# EAGLE design Buttons (EAGLE 8.6.0)
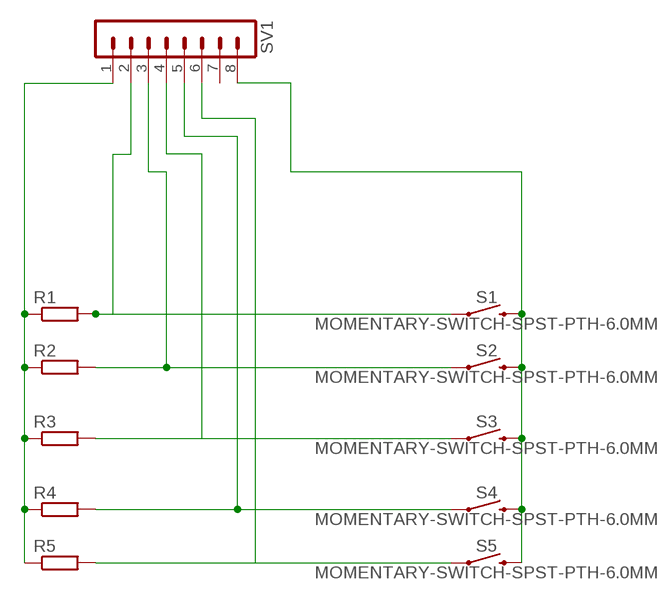
[diagram p0: schematic, sheet 1]

## Parts
R1  R0204/7  [0204/7]
R2  R0204/7  [0204/7]
R3  R0204/7  [0204/7]
R4  R0204/7  [0204/7]
R5  R0204/7  [0204/7]
S1  MOMENTARY-SWITCH-SPST-PTH-6.0MM  [TACTILE_SWITCH_PTH_6.0MM]
S2  MOMENTARY-SWITCH-SPST-PTH-6.0MM  [TACTILE_SWITCH_PTH_6.0MM]
S3  MOMENTARY-SWITCH-SPST-PTH-6.0MM  [TACTILE_SWITCH_PTH_6.0MM]
S4  MOMENTARY-SWITCH-SPST-PTH-6.0MM  [TACTILE_SWITCH_PTH_6.0MM]
S5  MOMENTARY-SWITCH-SPST-PTH-6.0MM  [TACTILE_SWITCH_PTH_6.0MM]
SV1  MA08-1  [MA08-1]

## Nets
N$1: R1.2 S1.1 SV1.2
N$2: R2.2 S2.1 SV1.3
N$3: R3.2 S3.1 SV1.4
N$4: R4.2 S4.1 SV1.5
N$5: R5.2 S5.1 SV1.6
N$6: R1.1 R2.1 R3.1 R4.1 R5.1 SV1.1
N$7: S1.3 S2.3 S3.3 S4.3 S5.3 SV1.8
Unconnected: SV1.7

## Library data of the parts
R1-R5 = eagle-ltspice:R: RESISTOR, European symbol; SPICEMODEL: NONE; SPICEPREFIX: R
S1-S5 = SparkFun-Switches:MOMENTARY-SWITCH-SPST: Momentary Switch (Pushbutton) - SPST Normally-open (NO) SPST momentary switches (buttons, pushbuttons). Variants PTH-12MM - 12mm square, through-hole Momentary Pushbutton Switch - 12mm Square <https://www.sparkfun.com/products/9190> (COM-09190) PTH-6.0MM, PTH-6.0MM-KIT - 6.0mm square, through-hole Mini Pushbutton Switch <https://www.sparkfun.com/products/97> (COM-00097) KIT package intended for soldering kit's - only one side of pads' copper is exposed. PTH-RIGHT-ANGLE-KIT - Right-angle, through-hole Right Angle Tactile Button <https://www.sparkfun.com/products/10791> - Used on SparkFun BigTime Watch Kit <https://www.sparkfun.com/products/11734> SMD-12MM - 12mm square, surface-mount Tactile Button - SMD (12mm) <https://www.sparkfun.com/products/12993> (COM-12993) Used on SparkFun PicoBoard <https://www.sparkfun.com/products/11888> SMD-4.5MM - 4.5mm Square Trackball Switch Used on SparkFun Blackberry Trackballer Breakout <https://www.sparkfun.com/products/13169> SMD-4.6MMX2.8MM - 4.60mm x 2.80mm, surface mount Used on SparkFun SAMD21 Mini Breakout <https://www.sparkfun.com/products/13664> SMD-5.2MM, SMD-5.2-REDUNDANT - 5.2mm square, surface-mount Mini Pushbutton Switch - SMD <https://www.sparkfun.com/products/8720> (COM-08720) Used on Arduino Pro Mini <https://www.sparkfun.com/products/11114> REDUNDANT package connects both switch circuits together SMD-6.0X3.5MM - 6.0 x 3.5mm, surface mount Momentary Reset Switch SMD <https://www.sparkfun.com/products/8229> (COM-08229) SMD-6.2MM-TALL - 6.2mm square, surface mount Tactile Button - SMD (6mm) <https://www.sparkfun.com/products/12992> Used on SparkFun Digital Sandbox <https://www.sparkfun.com/products/12651> SMD-RIGHT-ANGLE - Right-angle, surface mount Used on SparkFun Block for Intel® Edison - Arduino <https://www.sparkfun.com/products/13036>; PROD_ID: SWCH-08441; SF_SKU: COM-00097
SV1 = con-lstb:MA08-1: PIN HEADER; OC_FARNELL: unknown; OC_NEWARK: unknown

## Board
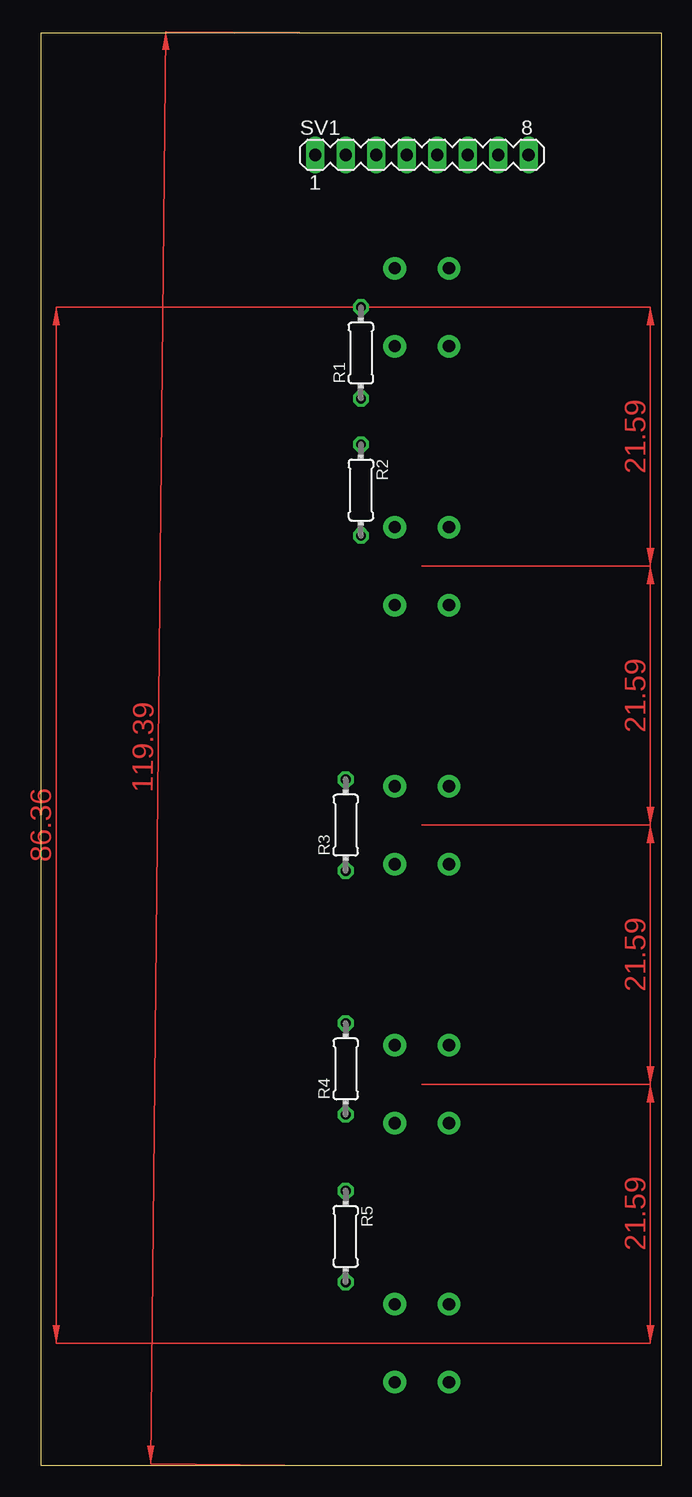
[diagram p1: board, top side]
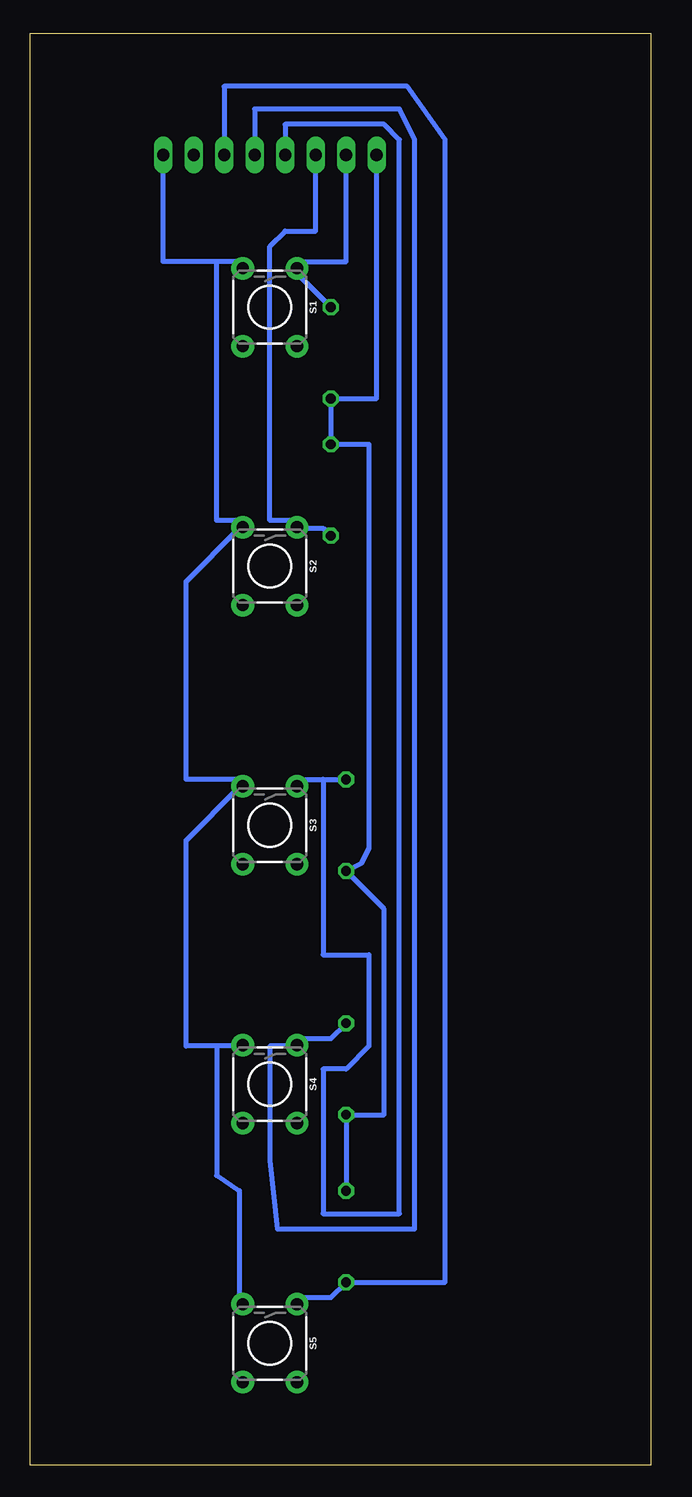
[diagram p2: board, bottom side, seen from below]

Size 51.74 x 119.37 mm. Coordinates in mm from the lower left corner, seen from the top.
Outline: 0,0 51.74,0 51.74,119.37 0,119.37 0,0
Copper layers (1*16): Top 0.035mm / dielectric 1.5mm / Bottom 0.035mm
Design rules "default *": minimum track width 16mil, minimum drill 0.35mm, track to track 16mil, track to pad 20mil, pad to pad 15mil, via to via 6mil, smd to smd 6mil, copper to edge 40mil, drill to drill 6mil, minimum pad ring 10mil, minimum via ring 8mil, stop-mask expansion 4mil, vias tented up to drill 0mil, thermal gap 10mil

### Footprints (pad centres in the part's own frame; a part is rotated, then mirrored left to right if it is on the bottom)
0204/7 = drill 0.813 octagon: 1 -3.81,0; 2 3.81,0
TACTILE_SWITCH_PTH_6.0MM = drill 1.016 pad 1.88: 1 -3.251,2.261; 2 3.251,2.261; 3 -3.251,-2.261; 4 3.251,-2.261
MA08-1 = drill 1.016 long: 1 -8.89,0; 2 -6.35,0; 3 -3.81,0; 4 -1.27,0; 5 1.27,0; 6 3.81,0; 7 6.35,0; 8 8.89,0

### Placement (x,y rotation side)
R1  26.67,92.71 90 top
R2  26.67,81.28 270 top
R3  25.4,53.34 90 top
R4  25.4,33.02 90 top
R5  25.4,19.05 270 top
S1  31.75,96.52 270 bottom
S2  31.75,74.93 270 bottom
S3  31.75,53.34 270 bottom
S4  31.75,31.75 270 bottom
S5  31.75,10.16 270 bottom
SV1  31.75,109.22 0 top

### Tracks (layer width: path | path; a pad name or v marks a point on that pad's centre or on a via)
N$1
  Bottom 0.406: R1.2 29.84,99.7 S1.1 29.21,100.33 25.4,100.33 SV1.2
N$2
  Bottom 0.406: R2.2 27.3,78.11 29.21,78.11 S2.1 29.84,78.74 31.75,78.74 31.75,101.6 30.48,102.87 27.94,102.87 SV1.3
N$3
  Bottom 0.406: 27.3,57.15 29.21,57.15 S3.1 | 27.3,57.15 R3.2 | SV1.4 30.48,111.76 22.23,111.76 20.95,110.49 20.95,20.95 27.3,20.95 27.3,33.02 25.4,33.02 23.49,34.93 23.49,42.55 27.3,42.55 27.3,57.15
N$4
  Bottom 0.406: R4.2 26.67,35.56 29.21,35.56 S4.1 29.84,34.93 31.75,34.93 31.75,25.4 31.12,19.69 19.69,19.69 19.69,110.49 20.95,113.03 33.02,113.03 SV1.5
N$5
  Bottom 0.406: S5.1 29.21,13.97 26.67,13.97 R5.2 17.14,15.24 17.14,110.49 20.32,114.94 35.56,114.94 SV1.6
N$6
  Bottom 0.406: R5.1 R4.1 22.23,29.21 22.23,46.36 R3.1 24.13,50.16 23.49,51.44 23.49,85.09 R2.1 R1.1 22.86,88.9 SV1.1
N$7
  Bottom 0.406: SV1.8 40.64,100.33 36.2,100.33 | 36.2,100.33 34.29,100.33 S1.3 | 36.2,34.93 36.2,24.13 34.29,22.86 34.29,13.97 S5.3 | 36.2,34.93 34.29,34.93 S4.3 | 36.2,34.93 38.73,34.93 38.73,52.07 34.29,56.52 S3.3 34.29,57.15 38.73,57.15 38.73,73.66 34.29,78.11 S2.3 34.29,78.74 36.2,78.74 36.2,100.33
(copper drawn outside any net)
  shapes: Top area x6